# EAGLE schematic Logic SchematicV4-w-DRC (EAGLE 6.3)
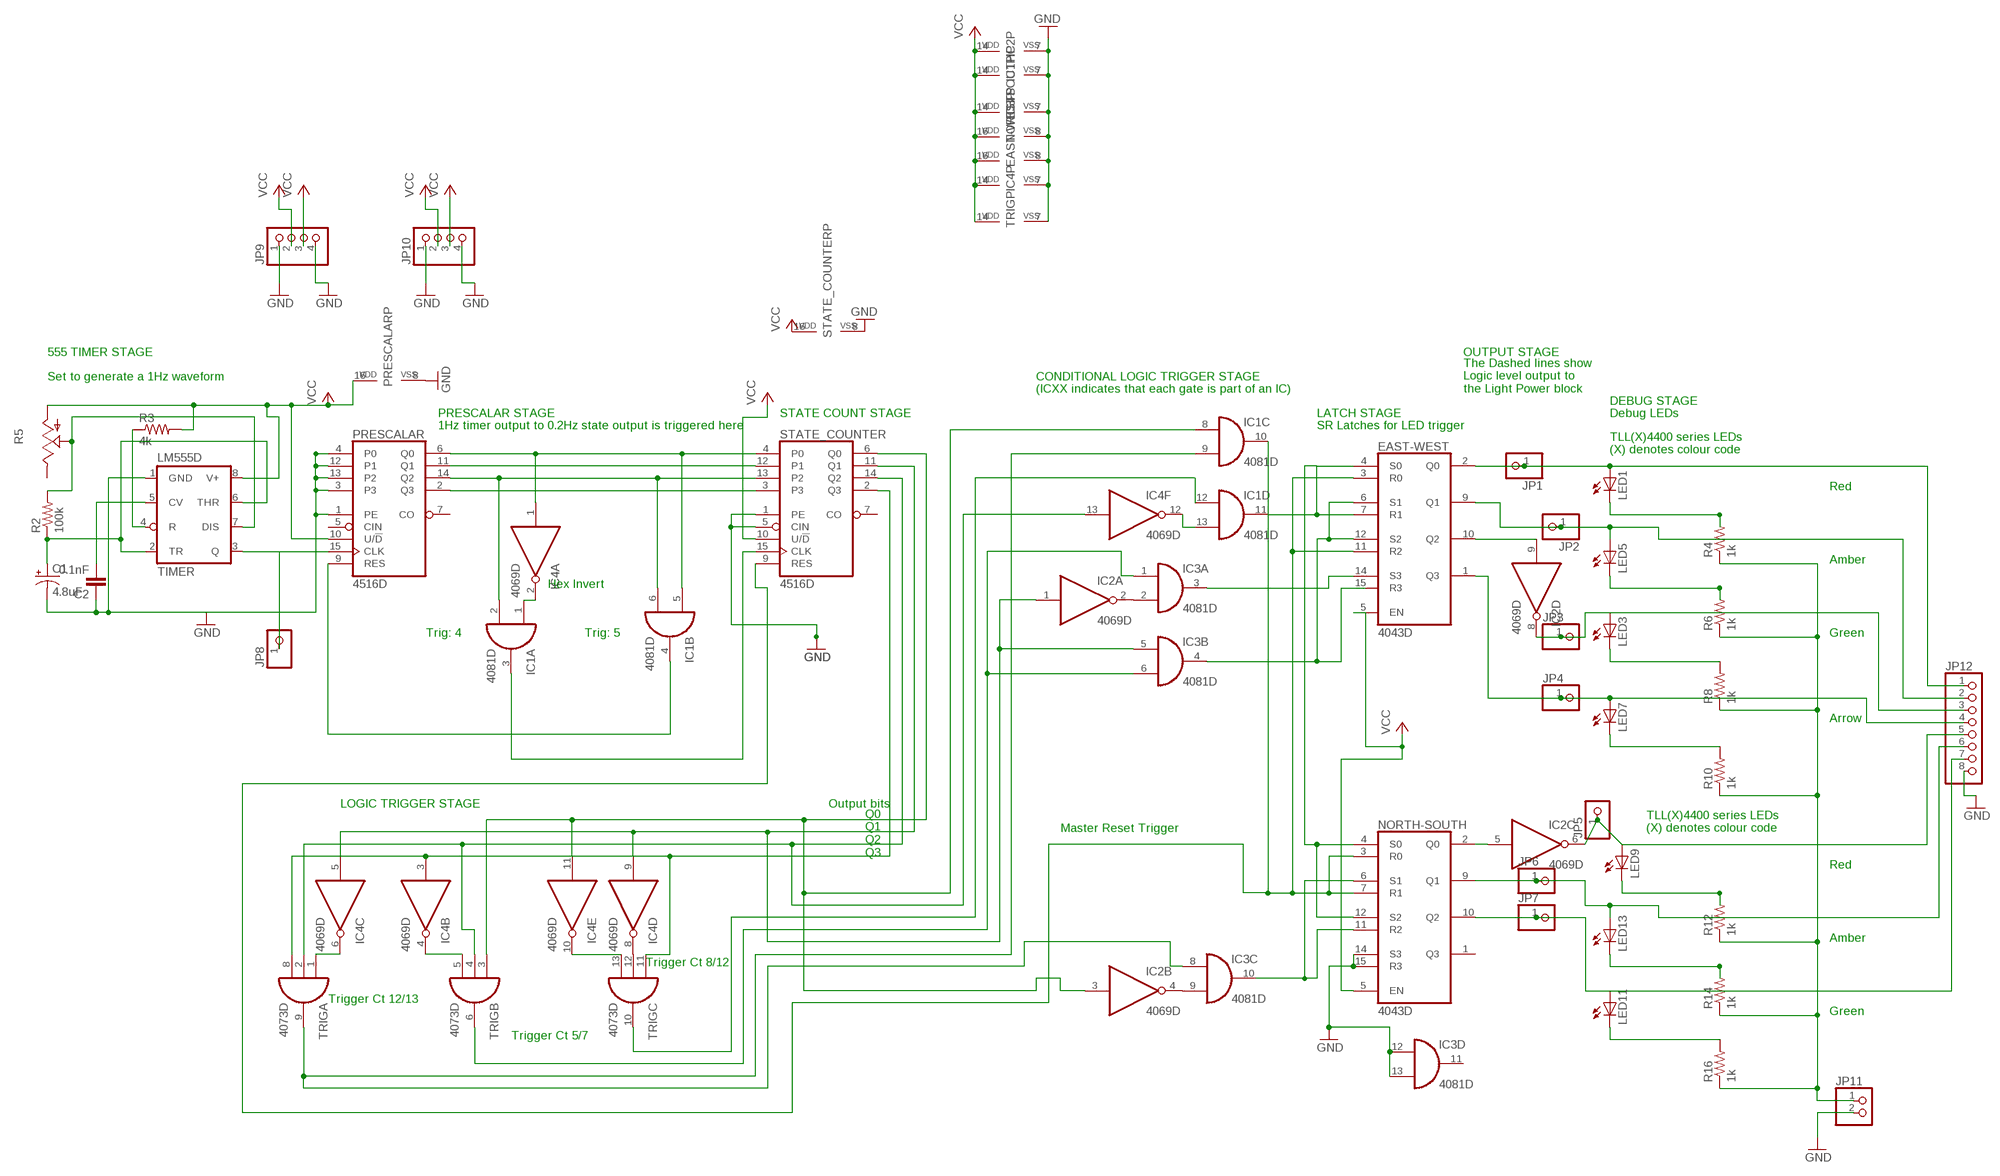
[diagram p0: schematic, sheet 1]

## Parts
C1  4.8uF  CPOL-USE5-8.5  [E5-8,5]
C2  0.1nF  C-EUC0805  [C0805]
EAST-WEST  4043D  [SO16]
IC1  4081D  [SO14]
IC2  4069D  [SO14]
IC3  4081D  [SO14]
IC4  4069D  [SO14]
JP1  PINHD-1X1  [1X01]
JP2  PINHD-1X1  [1X01]
JP3  PINHD-1X1  [1X01]
JP4  PINHD-1X1  [1X01]
JP5  PINHD-1X1  [1X01]
JP6  PINHD-1X1  [1X01]
JP7  PINHD-1X1  [1X01]
JP8  PINHD-1X1  [1X01]
JP9  PINHD-1X4  [1X04]
JP10  PINHD-1X4  [1X04]
JP11  PINHD-1X2  [1X02]
JP12  PINHD-1X8  [1X08]
LED1  LEDCHIP-LED0805  [CHIP-LED0805]
LED3  LEDCHIP-LED0805  [CHIP-LED0805]
LED5  LEDCHIP-LED0805  [CHIP-LED0805]
LED7  LEDCHIP-LED0805  [CHIP-LED0805]
LED9  LEDCHIP-LED0805  [CHIP-LED0805]
LED11  LEDCHIP-LED0805  [CHIP-LED0805]
LED13  LEDCHIP-LED0805  [CHIP-LED0805]
NORTH-SOUTH  4043D  [SO16]
PRESCALAR  4516D  [SO16]
R2  100k  R-US_M0805  [M0805]
R3  4k  R-US_M0805  [M0805]
R4  1k  R-US_M0805  [M0805]
R5  TRIM_US-B25P  [B25P]
R6  1k  R-US_M0805  [M0805]
R8  1k  R-US_M0805  [M0805]
R10  1k  R-US_M0805  [M0805]
R12  1k  R-US_M0805  [M0805]
R14  1k  R-US_M0805  [M0805]
R16  1k  R-US_M0805  [M0805]
STATE_COUNTER  4516D  [SO16]
TIMER  LM555D  [SO08]
TRIG  4073D  [SO14]

## Nets
GND: C1.- C2.1 EAST-WEST.8(VSS) IC1.7(P:VSS) IC2.7(P:VSS) IC3.7(P:VSS) IC3.12(D:I0) IC3.13(D:I1) IC4.7(P:VSS) JP9.1 JP9.4 JP10.1 JP10.4 JP11.2 JP12.8 NORTH-SOUTH.8(VSS) NORTH-SOUTH.14(S3) NORTH-SOUTH.15(R3) PRESCALAR.1(PE) PRESCALAR.3 PRESCALAR.4(P0) PRESCALAR.8(VSS) PRESCALAR.12(P1) PRESCALAR.13(P2) STATE_COUNTER.1(PE) STATE_COUNTER.5(CIN) STATE_COUNTER.8(VSS) TIMER.1(GND) TRIG.7(P:VSS)
N$1: PRESCALAR.2(Q3) STATE_COUNTER.3
N$2: EAST-WEST.2(Q0) JP1.1 JP12.1 LED1.A
N$3: IC1.3(A:O) STATE_COUNTER.15(CLK)
N$4: C1.+ R2.1 TIMER.2(TR) TIMER.6(THR)
N$5: R2.2 R5.S TIMER.7(DIS)
N$6: C2.2 TIMER.5(CV)
N$7: IC1.4(B:O) PRESCALAR.9(RES)
N$8: IC1.2(A:I1) IC1.6(B:I1) PRESCALAR.14(Q2) STATE_COUNTER.13(P2)
N$9: R3.1 TIMER.4(R)
N$10: PRESCALAR.11(Q1) STATE_COUNTER.12(P1)
N$12: IC2.2(A:O) IC3.2(A:I1)
N$13: IC3.10(C:O) NORTH-SOUTH.6(S1) NORTH-SOUTH.11(R2)
N$14: IC1.1(A:I0) IC4.2(A:O)
N$15: IC4.4(B:O) TRIG.5(B:I2)
N$16: IC1.9(C:I1) IC3.8(C:I0) TRIG.9(A:O)
N$17: IC2.1(A:I) IC3.5(B:I0) IC4.5(C:I) IC4.9(D:I) STATE_COUNTER.11(Q1)
N$18: IC4.6(C:O) TRIG.1(A:I0)
N$19: IC4.3(B:I) STATE_COUNTER.2(Q3) TRIG.8(A:I2) TRIG.11(C:I0)
N$20: JP8.1 PRESCALAR.15(CLK) TIMER.3(Q)
N$21: EAST-WEST.9(Q1) JP2.1 JP12.2 LED5.A
N$22: EAST-WEST.10(Q2) IC2.9(D:I)
N$23: IC2.8(D:O) JP3.1 JP12.3 LED3.A
N$24: LED1.C R4.2
N$25: JP11.1 R4.1 R6.1 R8.1 R10.1 R12.1 R14.1 R16.1
N$26: LED5.C R6.2
N$29: EAST-WEST.1(Q3) JP4.1 JP12.4 LED7.A
N$30: IC4.10(E:O) TRIG.13(C:I2)
N$31: LED3.C R8.2
N$33: LED7.C R10.2
N$35: IC3.1(A:I0) IC3.6(B:I1) TRIG.6(B:O)
N$36: IC4.8(D:O) TRIG.12(C:I1)
N$37: IC2.6(C:O) JP5.1 JP12.5 LED9.A
N$38: JP6.1 JP12.6 LED13.A NORTH-SOUTH.9(Q1)
N$39: IC1.13(D:I1) IC4.12(F:O)
N$40: JP7.1 JP12.7 LED11.A NORTH-SOUTH.10(Q2)
N$41: LED9.C R12.2
N$43: LED13.C R14.2
N$45: IC1.12(D:I0) TRIG.10(C:O)
N$46: LED11.C R16.2
N$50: IC2.5(C:I) NORTH-SOUTH.2(Q0)
N$52: EAST-WEST.4(S0) EAST-WEST.7(R1) IC1.11(D:O) NORTH-SOUTH.4(S0) NORTH-SOUTH.12(S2)
N$53: EAST-WEST.14(S3) IC3.3(A:O)
N$54: IC2.4(B:O) IC3.9(C:I1)
N$55: EAST-WEST.6(S1) EAST-WEST.12(S2) IC3.4(B:O)
N$56: EAST-WEST.3(R0) EAST-WEST.11(R2) IC1.10(C:O) NORTH-SOUTH.3(R0) NORTH-SOUTH.7(R1) STATE_COUNTER.9(RES)
N$59: IC4.13(F:I) STATE_COUNTER.14(Q2) TRIG.2(A:I1) TRIG.4(B:I1)
N$60: IC1.8(C:I0) IC2.3(B:I) IC4.11(E:I) STATE_COUNTER.6(Q0) TRIG.3(B:I0)
NOT: IC1.5(B:I0) IC4.1(A:I) PRESCALAR.6(Q0) STATE_COUNTER.4(P0)
VCC: EAST-WEST.5(EN) EAST-WEST.16(VDD) IC1.14(P:VDD) IC2.14(P:VDD) IC3.14(P:VDD) IC4.14(P:VDD) JP9.2 JP9.3 JP10.2 JP10.3 NORTH-SOUTH.5(EN) NORTH-SOUTH.16(VDD) PRESCALAR.10(U/!D) PRESCALAR.16(VDD) R3.2 R5.A STATE_COUNTER.10(U/!D) STATE_COUNTER.16(VDD) TIMER.8(V+) TRIG.14(P:VDD)
Unconnected: EAST-WEST.15(R3) IC2.10(E:O) IC2.11(E:I) IC2.12(F:O) IC2.13(F:I) IC3.11(D:O) NORTH-SOUTH.1(Q3) PRESCALAR.5(CIN) PRESCALAR.7(CO) R5.E STATE_COUNTER.7(CO)

## Notes on the sheet
- 555 TIMER STAGE | OUTPUT STAGE
- Set to generate a 1Hz waveform | CONDITIONAL LOGIC TRIGGER STAGE
- (ICXX indicates that each gate is part of an IC)
- The Dashed lines show
  Logic level output to
  the Light Power block
- DEBUG STAGE
- PRESCALAR STAGE | STATE COUNT STAGE | LATCH STAGE | Debug LEDs
- 1Hz timer output to 0.2Hz state output is triggered here | SR Latches for LED trigger
- TLL(X)4400 series LEDs
  (X) denotes colour code
- Red
- Amber
- Hex Invert
- Trig: 4 | Trig: 5 | Green
- Arrow
- LOGIC TRIGGER STAGE | Output bits
- Master Reset Trigger
- TLL(X)4400 series LEDs
  (X) denotes colour code
- Q0
  Q1
  Q2
  Q3
- Red
- Amber
- Trigger Ct 8/12
- Trigger Ct 12/13
- Green
- Trigger Ct 5/7

## Library data of the parts
C1 = resistor:CPOL-US: POLARIZED CAPACITOR, American symbol
C2 = resistor:C-EU: CAPACITOR, European symbol
EAST-WEST NORTH-SOUTH = 40xx:4043: Quad 3-state NOR R/S LATCH
IC1 IC3 = 40xx:4081: Quad 2-input AND
IC2 IC4 = 40xx:4069: Hex INVERTER
JP1-JP8 = pinhead:PINHD-1X1: PIN HEADER
JP9 JP10 = pinhead:PINHD-1X4: PIN HEADER
JP11 = pinhead:PINHD-1X2: PIN HEADER
JP12 = pinhead:PINHD-1X8: PIN HEADER
LED1 LED3 LED5 LED7 LED9 LED11 LED13 = led:LED: LED OSRAM: - CHIPLED LG R971, LG N971, LY N971, LG Q971, LY Q971, LO R971, LY R971 LH N974, LH R974 LS Q976, LO Q976, LY Q976 LO Q996 - Hyper CHIPLED LW Q18S LB Q993, LB Q99A, LB R99A - SideLED LS A670, LO A670, LY A670, LG A670, LP A670 LB A673, LV A673, LT A673, LW A673 LH A674 LY A675 LS A676, LA A676, LO A676, LY A676, LW A676 LS A679, LY A679, LG A679 - Hyper Micro SIDELED® LS Y876, LA Y876, LO Y876, LY Y876 LT Y87S - SmartLED LW L88C, LW L88S LB L89C, LB L89S, LG L890 LS L89K, LO L89K, LY L89K LS L896, LA L896, LO L896, LY L896 - TOPLED LS T670, LO T670, LY T670, LG T670, LP T670 LSG T670, LSP T670, LSY T670, LOP T670, LYG T670 LG T671, LOG T671, LSG T671 LB T673, LV T673, LT T673, LW T673 LH T674 LS T676, LA T676, LO T676, LY T676, LB T676, LH T676, LSB T676, LW T676 LB T67C, LV T67C, LT T67C, LS T67K, LO T67K, LY T67K, LW E67C LS E67B, LA E67B, LO E67B, LY E67B, LB E67C, LV E67C, LT E67C LW T67C LS T679, LY T679, LG T679 LS T770, LO T770, LY T770, LG T770, LP T770 LB T773, LV T773, LT T773, LW T773 LH T774 LS E675, LA E675, LY E675, LS T675 LS T776, LA T776, LO T776, LY T776, LB T776 LHGB T686 LT T68C, LB T68C - Hyper Mini TOPLED® LB M676 - Mini TOPLED Santana® LG M470 LS M47K, LO M47K, LY M47K Source: http://www.osram.convergy.de LUXEON: - LUMILED® LXK2-PW12-R00, LXK2-PW12-S00, LXK2-PW14-U00, LXK2-PW14-V00 LXK2-PM12-R00, LXK2-PM12-S00, LXK2-PM14-U00 LXK2-PE12-Q00, LXK2-PE12-R00, LXK2-PE12-S00, LXK2-PE14-T00, LXK2-PE14-U00 LXK2-PB12-K00, LXK2-PB12-L00, LXK2-PB12-M00, LXK2-PB14-N00, LXK2-PB14-P00, LXK2-PB14-Q00 LXK2-PR12-L00, LXK2-PR12-M00, LXK2-PR14-Q00, LXK2-PR14-R00 LXK2-PD12-Q00, LXK2-PD12-R00, LXK2-PD12-S00 LXK2-PH12-R00, LXK2-PH12-S00 LXK2-PL12-P00, LXK2-PL12-Q00, LXK2-PL12-R00 Source: www.luxeon.com KINGBRIGHT: KA-3528ASYC Source: www.kingbright.com
PRESCALAR STATE_COUNTER = 45xx:4516: Binary up down COUNTER
R2-R4 R6 R8 R10 R12 R14 R16 = resistor:R-US_: RESISTOR, American symbol
R5 = pot:TRIM_US-: POTENTIOMETER
TIMER = linear:*555: TIMER
TRIG = 40xx:4073: Triple 3-input AND

## Net classes
0 default: width 0.6 mm, drill 0.7 mm, clearance 0.2 mm